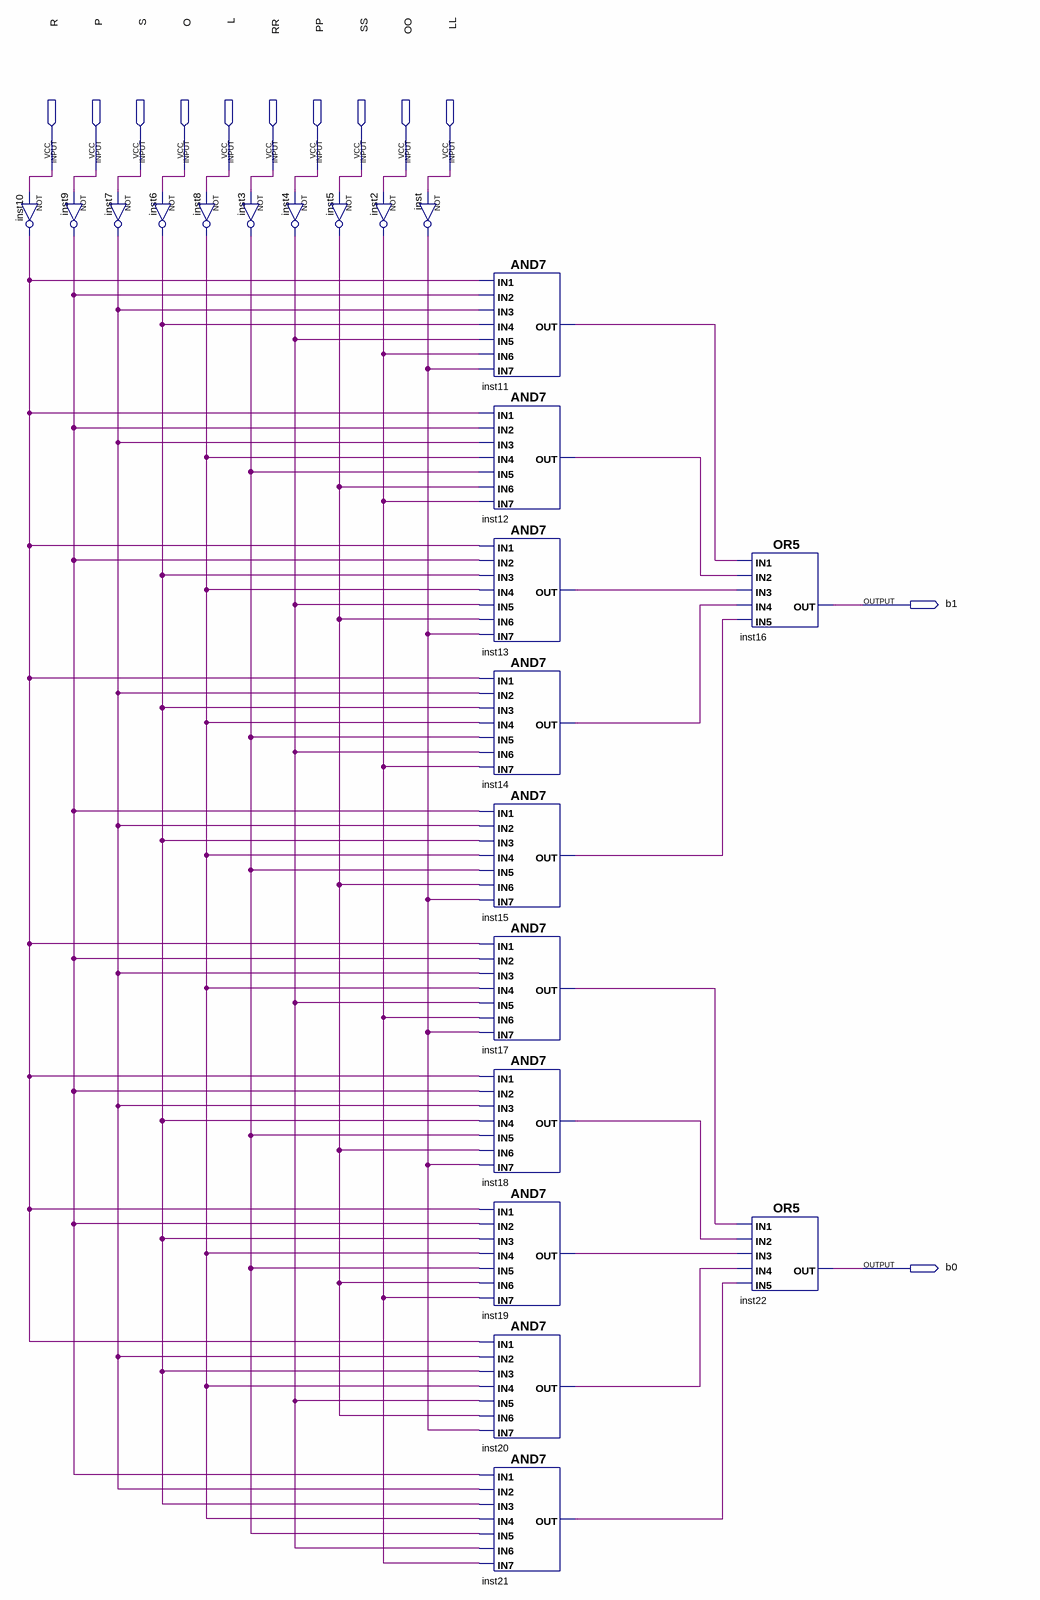
[diagram p0: schematic sheet]
// Quartus schematic whowins.bdf as structural Verilog: 22 symbols, 12 pins
module whowins (
  input  R,
  input  P,
  input  S,
  input  O,
  input  L,
  input  RR,
  input  PP,
  input  SS,
  input  OO,
  input  LL,
  output b1,
  output b0
);

  wire inst2_out, inst3_out, inst4_out, inst5_out, inst6_out, inst7_out, inst8_out, inst9_out, inst10_out,
       inst11_out, inst12_out, inst13_out, inst14_out, inst15_out, inst17_out, inst18_out, inst19_out,
       inst20_out, inst21_out, inst_out;

  not inst9 (inst9_out, P);
  not inst10 (inst10_out, R);
  not inst7 (inst7_out, S);
  not inst6 (inst6_out, O);
  not inst3 (inst3_out, RR);
  not inst8 (inst8_out, L);
  not inst4 (inst4_out, PP);
  not inst5 (inst5_out, SS);
  not inst (inst_out, LL);
  not inst2 (inst2_out, OO);
  and inst11 (inst11_out, inst10_out, inst9_out, inst7_out, inst6_out, inst4_out, inst2_out, inst_out);
  and inst12 (inst12_out, inst10_out, inst9_out, inst7_out, inst8_out, inst3_out, inst5_out, inst2_out);
  and inst13 (inst13_out, inst10_out, inst9_out, inst6_out, inst8_out, inst4_out, inst5_out, inst_out);
  and inst14 (inst14_out, inst10_out, inst7_out, inst6_out, inst8_out, inst3_out, inst4_out, inst2_out);
  and inst15 (inst15_out, inst9_out, inst7_out, inst6_out, inst8_out, inst3_out, inst5_out, inst_out);
  and inst17 (inst17_out, inst10_out, inst9_out, inst7_out, inst8_out, inst4_out, inst2_out, inst_out);
  and inst18 (inst18_out, inst10_out, inst9_out, inst7_out, inst6_out, inst3_out, inst5_out, inst_out);
  and inst19 (inst19_out, inst10_out, inst9_out, inst6_out, inst8_out, inst3_out, inst5_out, inst2_out);
  and inst20 (inst20_out, inst10_out, inst7_out, inst6_out, inst8_out, inst4_out, inst5_out, inst_out);
  and inst21 (inst21_out, inst9_out, inst7_out, inst6_out, inst8_out, inst3_out, inst4_out, inst2_out);
  or inst16 (b1, inst11_out, inst12_out, inst13_out, inst14_out, inst15_out);
  or inst22 (b0, inst17_out, inst18_out, inst19_out, inst20_out, inst21_out);
endmodule
